# Altium schematic sheet Microcontroller.SchDoc
size B; SheetNumber: 1; SheetTotal: 12
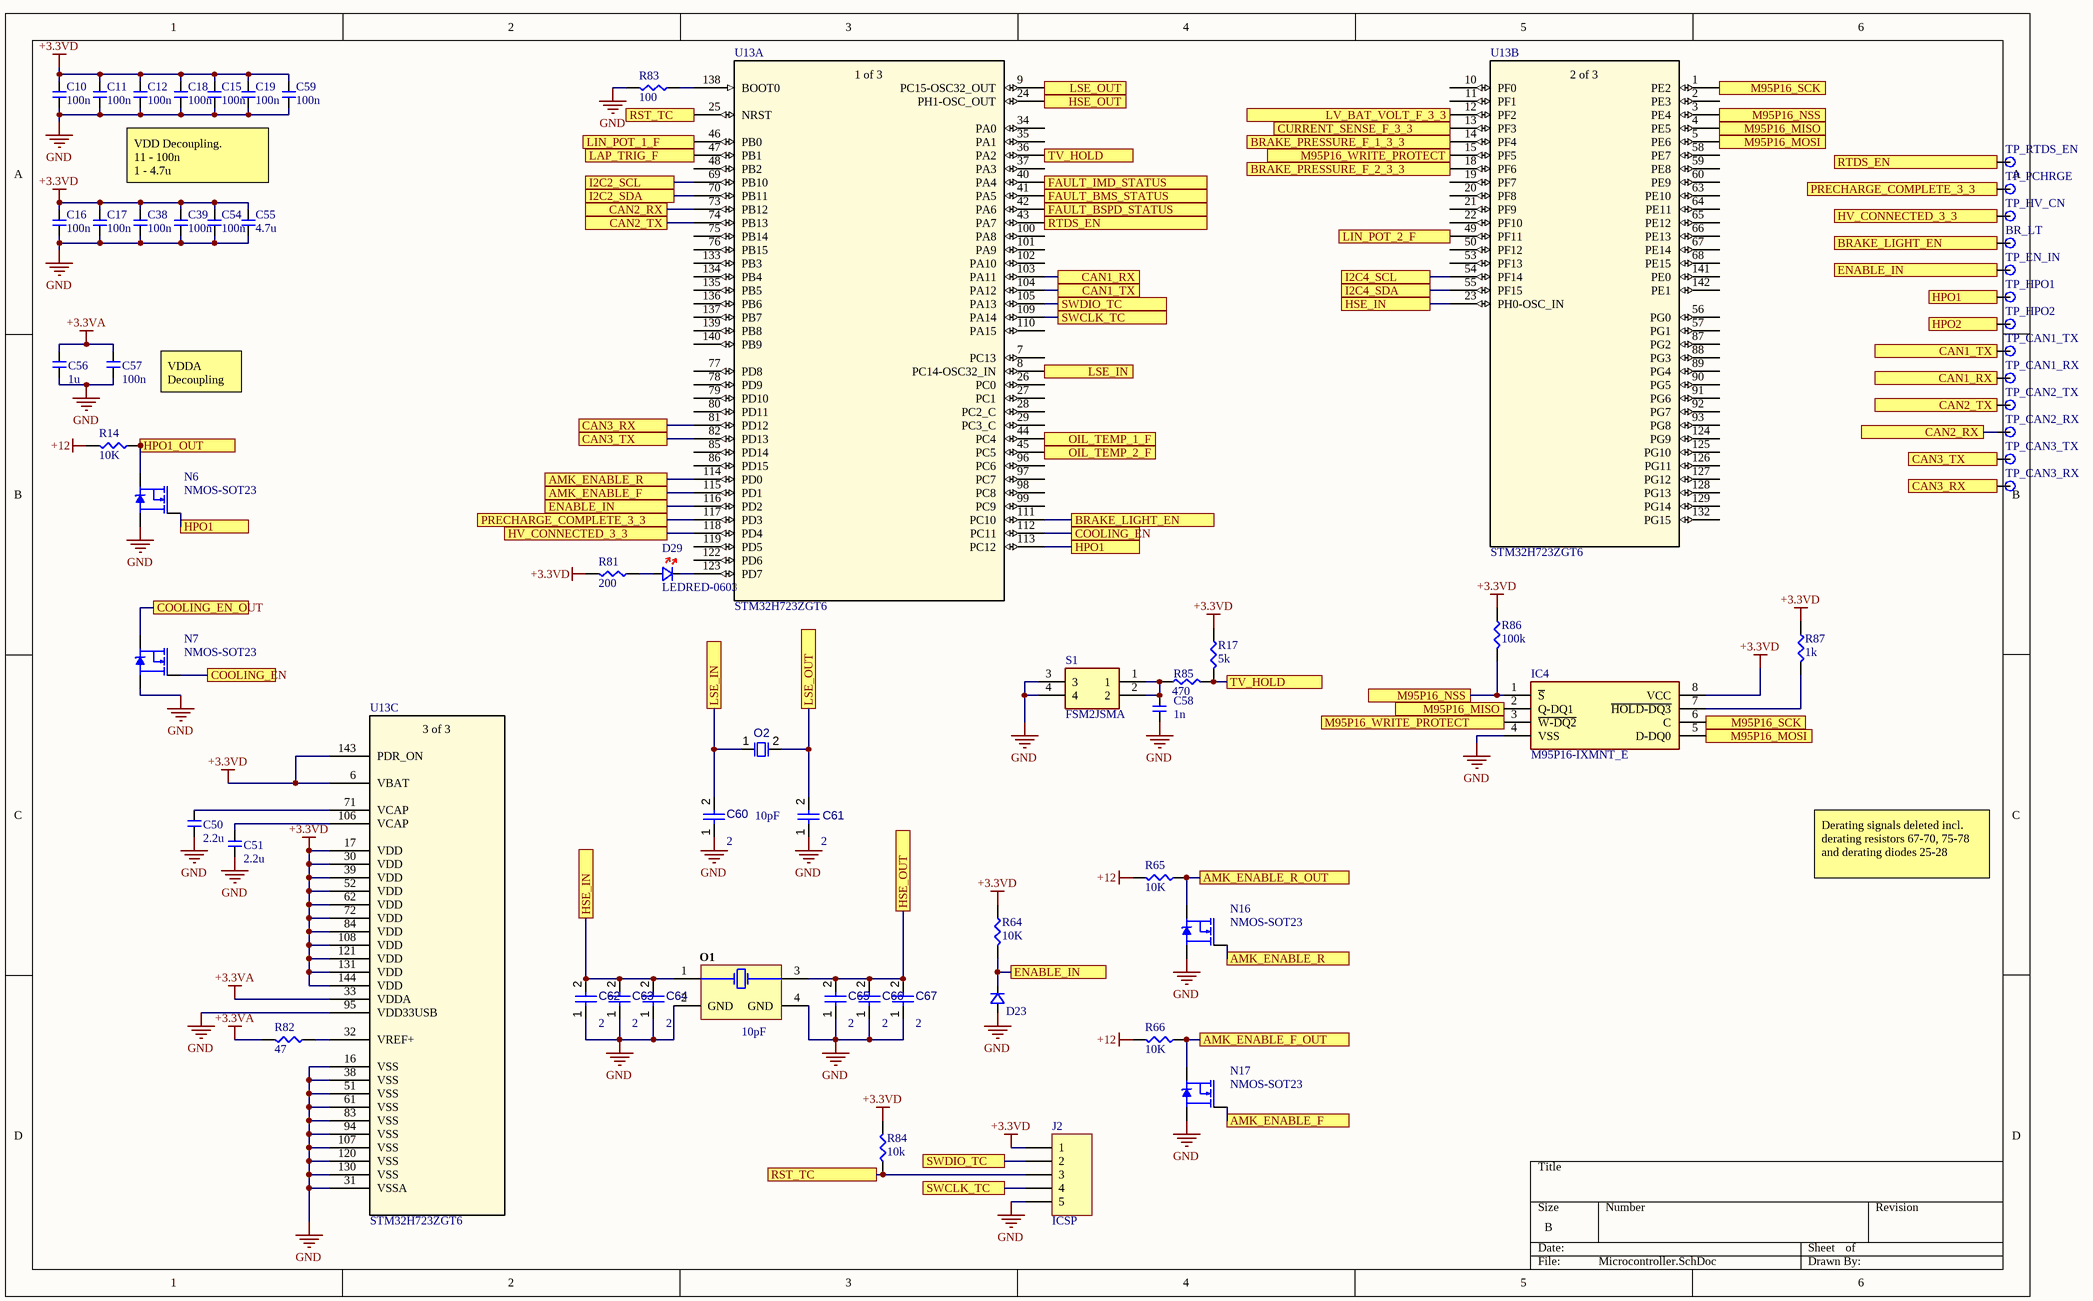
[diagram p0: Microcontroller.SchDoc]

## Parts
BR_LT  (no value)  [Testpoint]
C10  100n  [CAP-0603]
C11  100n  [CAP-0603]
C12  100n  [CAP-0603]
C15  100n  [CAP-0603]
C16  100n  [CAP-0603]
C17  100n  [CAP-0603]
C18  100n  [CAP-0603]
C19  100n  [CAP-0603]
C38  100n  [CAP-0603]
C39  100n  [CAP-0603]
C50  2.2u  [CAP-0603]
C51  2.2u  [CAP-0603]
C54  100n  [CAP-0603]
C55  4.7u  [CAP-0603]
C56  1u  [CAP-0603]
C57  100n  [CAP-0603]
C58  1n  [CAP-0603]
C59  100n  [CAP-0603]
C60  Pins: 2  [CAPC0603(1608)100_L]  (hidden comment: CMP-001-00014-4)
C61  value 10pF  Pins: 2  [CAPC0603(1608)100_L]  (hidden comment: CMP-001-00014-4)
C62  Pins: 2  [CAPC0603(1608)100_L]  (hidden comment: CMP-001-00014-4)
C63  Pins: 2  [CAPC0603(1608)100_L]  (hidden comment: CMP-001-00014-4)
C64  Pins: 2  [CAPC0603(1608)100_L]  (hidden comment: CMP-001-00014-4)
C65  Pins: 2  [CAPC0603(1608)100_L]  (hidden comment: CMP-001-00014-4)
C66  Pins: 2  [CAPC0603(1608)100_L]  (hidden comment: CMP-001-00014-4)
C67  Pins: 2  [CAPC0603(1608)100_L]  (hidden comment: CMP-001-00014-4)
D23  12V ZENER  [SOD123]  (value not drawn)
D29  LEDRED-0603  [LEDRED-0603]
IC4  M95P16-IXMNT_E  [SOIC127P600X175-8N]
J2  ICSP  [TC2030-MCP]
N6  NMOS-SOT23  [SOT23]
N7  NMOS-SOT23  [SOT23]
N16  NMOS-SOT23  [SOT23]
N17  NMOS-SOT23  [SOT23]
O1  12.288Mhz_HSE  [ABRA-ABM3B-4_V]  (value not drawn)
O2  32kHz_LSE  [EPSON-FC-135_V]  (value not drawn)
R14  10K  [RES-0603]
R17  5k  [RES-0603]
R64  10K  [RES-0603]
R65  10K  [RES-0603]
R66  10K  [RES-0603]
R81  200  [RES-0603]
R82  47  [RES-0603]
R83  100  [RES-0603]
R84  10k  [RES-0603]
R85  470  [RES-0603]
R86  100k  [RES-0603]
R87  1k  [RES-0603]
S1  FSM2JSMA  [FSM2J]
TP_CAN1_RX  (no value)  [Testpoint]
TP_CAN1_TX  (no value)  [Testpoint]
TP_CAN2_RX  (no value)  [Testpoint]
TP_CAN2_TX  (no value)  [Testpoint]
TP_CAN3_RX  (no value)  [Testpoint]
TP_CAN3_TX  (no value)  [Testpoint]
TP_EN_IN  (no value)  [Testpoint]
TP_HPO1  (no value)  [Testpoint]
TP_HPO2  (no value)  [Testpoint]
TP_HV_CN  (no value)  [Testpoint]
TP_PCHRGE  (no value)  [Testpoint]
TP_RTDS_EN  (no value)  [Testpoint]
U13  STM32H723ZGT6  [LQFP144_STM]  (parts A,B,C of 3)

## Ports
AMK_ENABLE_F, AMK_ENABLE_F_OUT, AMK_ENABLE_R, AMK_ENABLE_R_OUT, BRAKE_LIGHT_EN, BRAKE_PRESSURE_F_1_3_3, BRAKE_PRESSURE_F_2_3_3, CAN1_RX, CAN1_TX, CAN2_RX, CAN2_TX, CAN3_RX, CAN3_TX, COOLING_EN, COOLING_EN_OUT, CURRENT_SENSE_F_3_3, ENABLE_IN, FAULT_BMS_STATUS, FAULT_BSPD_STATUS, FAULT_IMD_STATUS, HPO1, HPO1_OUT, HPO2, HSE_IN, HSE_OUT, HV_CONNECTED_3_3, I2C2_SCL, I2C2_SDA, I2C4_SCL, I2C4_SDA, LAP_TRIG_F, LIN_POT_1_F, LIN_POT_2_F, LSE_IN, LSE_OUT, LV_BAT_VOLT_F_3_3, M95P16_MISO, M95P16_MOSI, M95P16_NSS, M95P16_SCK, M95P16_WRITE_PROTECT, OIL_TEMP_1_F, OIL_TEMP_2_F, PRECHARGE_COMPLETE_3_3, RST_TC, RTDS_EN, SWCLK_TC, SWDIO_TC, TV_HOLD

## Nets
+3.3VA: C56.2 C57.2 R82.2 U13.33(VDDA)
+3.3VD: C10.2 C11.2 C12.2 C15.2 C16.2 C17.2 C18.2 C19.2 C38.2 C39.2 C54.2 C55.2 C59.2 IC4.8(VCC) J2.1 R17.1 R64.1 R81.2 R84.2 R86.1 R87.1 U13.6(VBAT) U13.17(VDD) U13.30(VDD) U13.39(VDD) U13.52(VDD) U13.62(VDD) U13.72(VDD) U13.84(VDD) U13.108(VDD) U13.121(VDD) U13.131(VDD) U13.143(PDR_ON) U13.144(VDD)
+12: R14.2 R65.2 R66.2
GND: C10.1 C11.1 C12.1 C15.1 C16.1 C17.1 C18.1 C19.1 C38.1 C39.1 C50.1 C51.1 C54.1 C55.1 C56.1 C57.1 C58.1 C59.1 C60.1 C61.1 C62.1 C63.1 C64.1 C65.1 C66.1 C67.1 D23.A IC4.4(VSS) J2.5 N6.2(S) N7.2(S) N16.2(S) N17.2(S) O1.2(GND) O1.4(GND) R83.2 S1.3 S1.4 U13.16(VSS) U13.31(VSSA) U13.38(VSS) U13.51(VSS) U13.61(VSS) U13.83(VSS) U13.94(VSS) U13.95(VDD33USB) U13.107(VSS) U13.120(VSS) U13.130(VSS)
AMK_ENABLE_F: N17.1(G) U13.115(PD1) ; port AMK_ENABLE_F
AMK_ENABLE_F_OUT: N17.3(D) R66.1 ; port AMK_ENABLE_F_OUT
AMK_ENABLE_R: N16.1(G) U13.114(PD0) ; port AMK_ENABLE_R
AMK_ENABLE_R_OUT: N16.3(D) R65.1 ; port AMK_ENABLE_R_OUT
BRAKE_LIGHT_EN: BR_LT.1 U13.111(PC10) ; port BRAKE_LIGHT_EN
BRAKE_PRESSURE_F_1_3_3: U13.14(PF4) ; port BRAKE_PRESSURE_F_1_3_3
BRAKE_PRESSURE_F_2_3_3: U13.18(PF6) ; port BRAKE_PRESSURE_F_2_3_3
CAN1_RX: TP_CAN1_RX.1 U13.103(PA11) ; port CAN1_RX
CAN1_TX: TP_CAN1_TX.1 U13.104(PA12) ; port CAN1_TX
CAN2_RX: TP_CAN2_RX.1 U13.73(PB12) ; port CAN2_RX
CAN2_TX: TP_CAN2_TX.1 U13.74(PB13) ; port CAN2_TX
CAN3_RX: TP_CAN3_RX.1 U13.81(PD12) ; port CAN3_RX
CAN3_TX: TP_CAN3_TX.1 U13.82(PD13) ; port CAN3_TX
COOLING_EN: N7.1(G) U13.112(PC11) ; port COOLING_EN
COOLING_EN_OUT: N7.3(D) ; port COOLING_EN_OUT
CURRENT_SENSE_F_3_3: U13.13(PF3) ; port CURRENT_SENSE_F_3_3
ENABLE_IN: D23.K R64.2 TP_EN_IN.1 U13.116(PD2) ; port ENABLE_IN
FAULT_BMS_STATUS: U13.41(PA5) ; port FAULT_BMS_STATUS
FAULT_BSPD_STATUS: U13.42(PA6) ; port FAULT_BSPD_STATUS
FAULT_IMD_STATUS: U13.40(PA4) ; port FAULT_IMD_STATUS
HPO1: N6.1(G) TP_HPO1.1 U13.113(PC12) ; port HPO1
HPO1_OUT: N6.3(D) R14.1 ; port HPO1_OUT
HPO2: TP_HPO2.1 ; port HPO2
HSE_IN: C62.2 C63.2 C64.2 O1.1(X1) U13.23(PH0-OSC_IN) ; port HSE_IN
HSE_OUT: C65.2 C66.2 C67.2 O1.3(X2) U13.24(PH1-OSC_OUT) ; port HSE_OUT
HV_CONNECTED_3_3: TP_HV_CN.1 U13.118(PD4) ; port HV_CONNECTED_3_3
I2C2_SCL: U13.69(PB10) ; port I2C2_SCL
I2C2_SDA: U13.70(PB11) ; port I2C2_SDA
I2C4_SCL: U13.54(PF14) ; port I2C4_SCL
I2C4_SDA: U13.55(PF15) ; port I2C4_SDA
LAP_TRIG_F: U13.47(PB1) ; port LAP_TRIG_F
LIN_POT_1_F: U13.46(PB0) ; port LIN_POT_1_F
LIN_POT_2_F: U13.49(PF11) ; port LIN_POT_2_F
LSE_IN: C60.2 O2.1 U13.8(PC14-OSC32_IN) ; port LSE_IN
LSE_OUT: C61.2 O2.2 U13.9(PC15-OSC32_OUT) ; port LSE_OUT
LV_BAT_VOLT_F_3_3: U13.12(PF2) ; port LV_BAT_VOLT_F_3_3
M95P16_MISO: IC4.2(Q-DQ1) U13.4(PE5) ; port M95P16_MISO
M95P16_MOSI: IC4.5(D-DQ0) U13.5(PE6) ; port M95P16_MOSI
M95P16_NSS: IC4.1(~{S}) R86.2 U13.3(PE4) ; port M95P16_NSS
M95P16_SCK: IC4.6(C) U13.1(PE2) ; port M95P16_SCK
M95P16_WRITE_PROTECT: IC4.3(~{W-DQ2}) U13.15(PF5) ; port M95P16_WRITE_PROTECT
OIL_TEMP_1_F: U13.44(PC4) ; port OIL_TEMP_1_F
OIL_TEMP_2_F: U13.45(PC5) ; port OIL_TEMP_2_F
PRECHARGE_COMPLETE_3_3: TP_PCHRGE.1 U13.117(PD3) ; port PRECHARGE_COMPLETE_3_3
RST_TC: J2.3 R84.1 U13.25(NRST) ; port RST_TC
RTDS_EN: TP_RTDS_EN.1 U13.43(PA7) ; port RTDS_EN
SWCLK_TC: J2.4 U13.109(PA14) ; port SWCLK_TC
SWDIO_TC: J2.2 U13.105(PA13) ; port SWDIO_TC
TV_HOLD: R17.2 R85.2 U13.36(PA2) ; port TV_HOLD
NetC50_2: C50.2 U13.71(VCAP)
NetC51_2: C51.2 U13.106(VCAP)
NetC58_2: C58.2 R85.1 S1.1 S1.2
NetD29_A: D29.A R81.1
NetD29_K: D29.K U13.123(PD7)
NetIC4_7: IC4.7(~{HOLD-DQ3}) R87.2
NetR82_1: R82.1 U13.32(VREF+)
NetR83_1: R83.1 U13.138(BOOT0)

Not connected (* = marked no-connect by the designer): U13 2(PE3) 7(PC13) 10(PF0) 11(PF1) 19(PF7) 20(PF8) 21(PF9) 22(PF10) 26(PC0) 27(PC1) 28(PC2_C) 29(PC3_C) 34(PA0) 35(PA1) 37(PA3) 48(PB2) 50(PF12) 53(PF13) 56(PG0) 57(PG1) 58(PE7) 59(PE8) 60(PE9) 63(PE10) 64(PE11) 65(PE12) 66(PE13) 67(PE14) 68(PE15) 75(PB14) 76(PB15) 77(PD8) 78(PD9) 79(PD10) 80(PD11) 85(PD14) 86(PD15) 87(PG2) 88(PG3) 89(PG4) 90(PG5) 91(PG6) 92(PG7) 93(PG8) 96(PC6) 97(PC7) 98(PC8) 99(PC9) 100(PA8) 101(PA9) 102(PA10) 110(PA15) 119(PD5) 122(PD6) 124(PG9) 125(PG10) 126(PG11) 127(PG12) 128(PG13) 129(PG14) 132(PG15) 133(PB3) 134(PB4) 135(PB5) 136(PB6) 137(PB7) 139(PB8) 140(PB9) 141(PE0) 142(PE1)

## Notes on the sheet
- VDD Decoupling.
  11 - 100n
  1 - 4.7u
- VDDA Decoupling
- Derating signals deleted incl. derating resistors 67-70, 75-78 and derating diodes 25-28
- (near O1) 10pF
- (in symbol CMP-002-000002-1, part A) 1 of 3
- (in symbol CMP-002-000002-1, part B) 2 of 3
- (in symbol CMP-002-000002-1, part C) 3 of 3

## Library data of the parts
BR_LT TP_CAN1_RX TP_CAN1_TX TP_CAN2_RX TP_CAN2_TX TP_CAN3_RX TP_CAN3_TX TP_EN_IN TP_HPO1 TP_HPO2 TP_HV_CN TP_PCHRGE TP_RTDS_EN = Testpoint
C10-C12 C15-C19 C38 C39 C50 C51 C54-C59 = CAP-0603
C60 C62-C67 = CMP-005-000574-1: Chip Capacitor, 10 pF, +/- 5%, 50 V, 0603 (1608 Metric); Voltage Rating: 50V; Capacitor Type: Ceramic; Value: 10pF; Available Preview Images: 2D; Tolerance: 5%; Mounting Technology: SM; RoHS Compliant: True; Case/Package: 0603; Max Operating Temperature: 125°C; Min Operating Temperature: -55°C; Source: Integrated_Library - 12.03.21 - 15.39.SchLib; Design Item ID: CMP-001-00014-4
C61 = CMP-005-000574-1: Chip Capacitor, 10 pF, +/- 5%, 50 V, 0603 (1608 Metric); Voltage Rating: 50V; Capacitor Type: Ceramic; Available Preview Images: 2D; Tolerance: 5%; Mounting Technology: SM; RoHS Compliant: True; Case/Package: 0603; Max Operating Temperature: 125°C; Min Operating Temperature: -55°C; Source: Integrated_Library - 12.03.21 - 15.39.SchLib; Design Item ID: CMP-001-00014-4
D23 = DIODE-SOD123
IC4 = CMP-074-000000-1: Ultra low-power 16 Mbit Serial SPI Page EEPROM; Manufacturer_Part_Number: M95P16-IXMNT/E; Manufacturer_Name: STMicroelectronics; Geometry.Height: 1.75mm; Datasheet Link: https://www.st.com/resource/en/datasheet/m95p16-i.pdf; Mouser Price/Stock: *; Design Item ID: M95P16-IXMNT_E; Source: M95P16-IXMNT_E.SchLib; Mouser Part Number: *
O1 = CMP-013-000014-1: Ceramic SMD Crystal, 12.288 MHz, +/- 20 ppm, 18 pF, -20 to 70 degC, 4-Pin SMD, RoHS, Tape and Reel; Manufacturer: Abracon; Resistance: 70Ohm; Load Capacitance: 18pF; Tolerance: 20ppm; ESR: 70; Mounting Technology: SM; Datasheet Version: Aug-15; RoHS Compliant: True; Frequency: 12.288MHz; Manufacturer URL: http://www.abracon.com/; Package Quantity: 1000; Frequency Tolerance: 20ppm; Source: Integrated_Library - 12.03.21 - 15.39.SchLib; Design Item ID: CMP-003-00016-1; Case/Package: CSMD; Package Reference: ABM3B; Package Description: 4-Pin Surface Mount Device, Body 5 x 3.2 mm; Datasheet URL: http://www.abracon.com/Resonators/abm3b.pdf; Min Operating Temperature: -20°C; Packaging: TapeandReel; Max Operating Temperature: 70°C; Pins: 4
O2 = CMP-013-000026-1: Crystal 32.768kHz 10ppm 7pF -40C +85C; Pins: 2; Source: Integrated_Library - 12.03.21 - 15.39.SchLib; Frequency: 32.768kHz; Design Item ID: CMP-003-00029-1
R14 R17 R64-R66 R81-R85 = RES-0603
R86 = CMP-055-000008-1: Pull up for CS line; Design Item ID: RES-0603; Source: ife19_Elec_Library.SchLib
R87 = CMP-055-000008-1: Design Item ID: RES-0603; Source: ife19_Elec_Library.SchLib
S1 = FSM2JSMA: Switch; Manufacturer_Name: TE Connectivity; Datasheet Link: http://www.te.com/commerce/DocumentDelivery/DDEController?Action=showdoc&DocId=Customer+Drawing%7F2-1437565-7%7FV%7Fpdf%7FEnglish%7FENG_CD_2-1437565-7_V.pdf%7F2-1437565-7; Manufacturer_Part_Number: FSM2JSMA; Mouser Part Number: 506-FSM2JSMA; Mouser Price/Stock: https://www.mouser.co.uk/ProductDetail/TE-Connectivity-PB/FSM2JSMA?qs=WxIUe09p%2FPM9lESJXEVb2Q%3D%3D; Arrow Part Number: FSM2JSMA; Arrow Price/Stock: https://www.arrow.com/en/products/fsm2jsma/te-connectivity?region=nac
U13 = CMP-002-000002-1: No Description Available; Mfr_Name: STMicroelectronics; Copyright: Copyright (C) 2022 Ultra Librarian. All rights reserved.; RefDes: RefDes; Design Item ID: STM32H723ZGT6; Manufacturer_Part_Number: STM32H723ZGT6; Type: DEV; Source: STM32H723ZGT6.SchLib